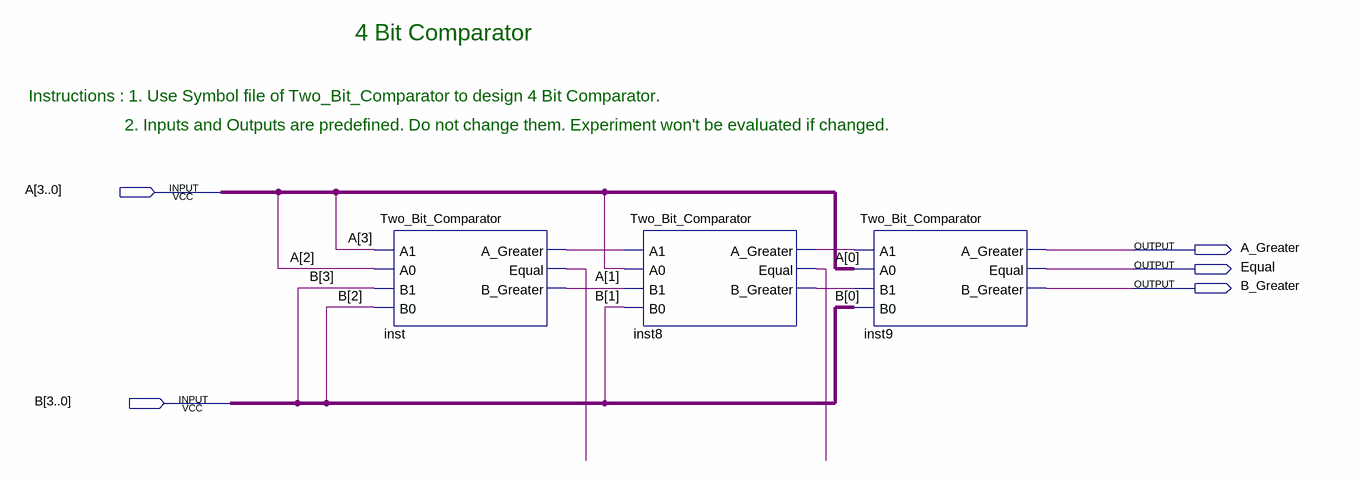
[diagram p0: schematic sheet]
// Quartus schematic Four_Bit_Comparator.bdf as structural Verilog: 3 symbols, 5 pins
module Four_Bit_Comparator (
  input  [3:0] A,
  input  [3:0] B,
  output A_Greater,
  output Equal,
  output B_Greater
);

  wire inst8_a_greater, inst8_b_greater, inst8_equal, inst_a_greater, inst_b_greater, inst_equal;

  Two_Bit_Comparator inst (
    .A1(A[3]), .A0(A[2]), .B1(B[3]), .B0(B[2]), .A_Greater(inst_a_greater), .Equal(inst_equal),
    .B_Greater(inst_b_greater));
  Two_Bit_Comparator inst8 (
    .A1(inst_a_greater), .A0(A[1]), .B1(inst_b_greater), .B0(B[1]), .A_Greater(inst8_a_greater),
    .Equal(inst8_equal), .B_Greater(inst8_b_greater));
  Two_Bit_Comparator inst9 (
    .A1(inst8_a_greater), .A0(A[0]), .B1(inst8_b_greater), .B0(B[0]), .A_Greater(A_Greater), .Equal(Equal),
    .B_Greater(B_Greater));

  // Notes on the sheet:
  //   4 Bit Comparator
  //   Instructions : 1. Use Symbol file of Two_Bit_Comparator to design 4 Bit Comparator. 
  //   2. Inputs and Outputs are predefined. Do not change them. Experiment won't be evaluated if changed.
endmodule
